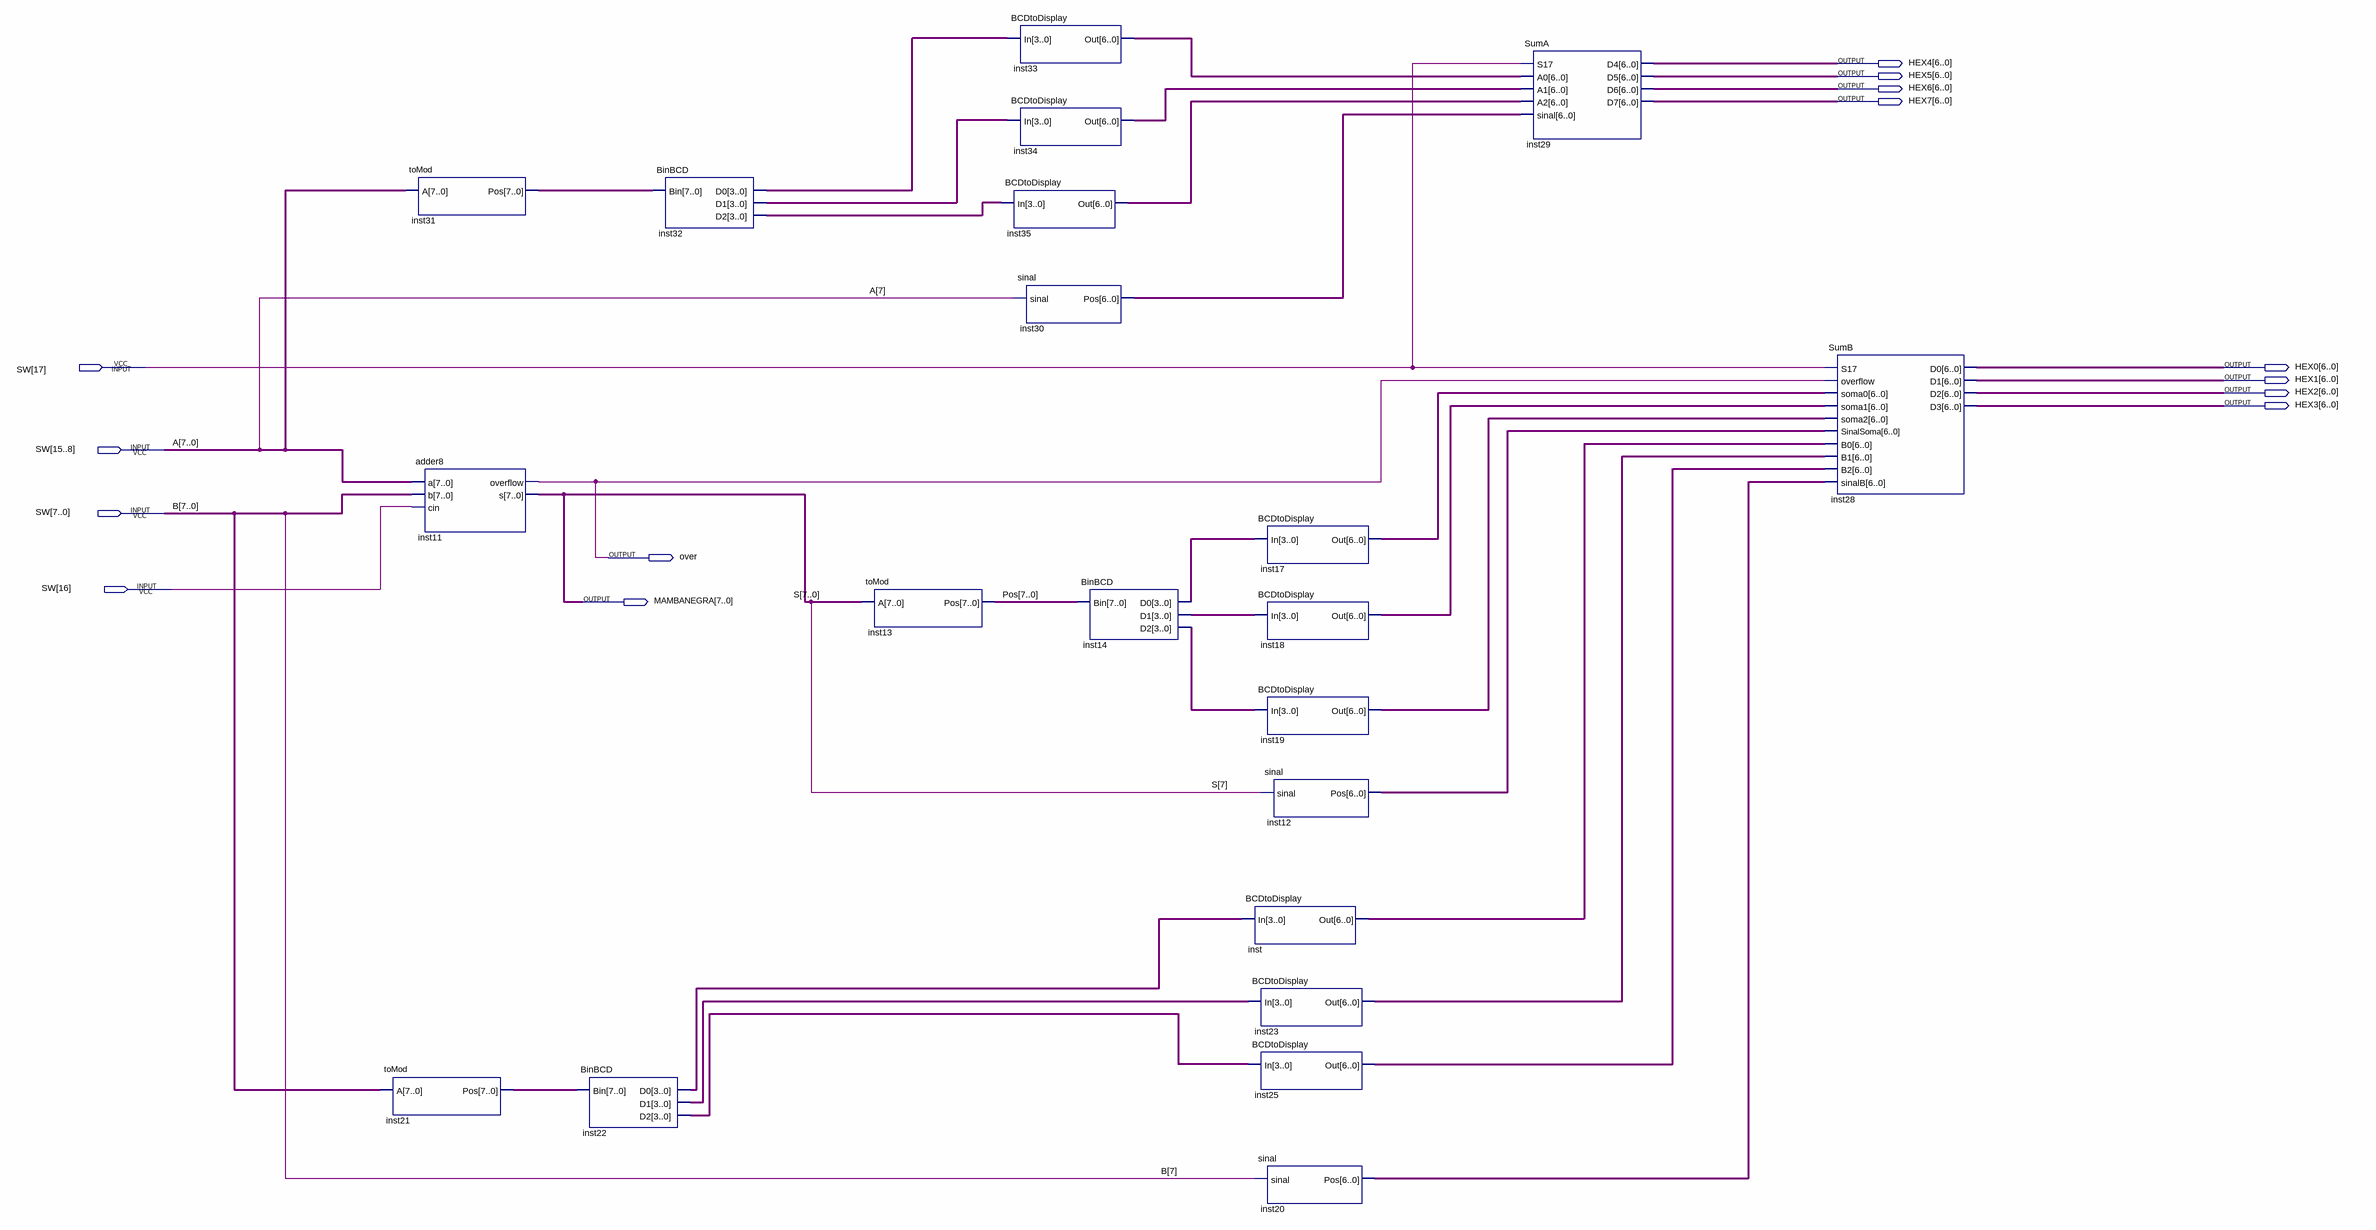
[diagram p0: schematic sheet]
// Quartus schematic Display.bdf as structural Verilog: 21 symbols, 14 pins
module Display (
  input  [17:0] SW,
  output [6:0] HEX4,
  output [6:0] HEX5,
  output [6:0] HEX6,
  output [6:0] HEX7,
  output [6:0] HEX0,
  output [6:0] HEX1,
  output [6:0] HEX2,
  output [6:0] HEX3,
  output over,
  output [7:0] MAMBANEGRA
);

  wire [3:0] inst14_d0, inst14_d1, inst14_d2, inst22_d0, inst22_d1, inst22_d2, inst32_d0, inst32_d1,
       inst32_d2;
  wire [6:0] inst12_pos, inst17_out, inst18_out, inst19_out, inst20_pos, inst23_out, inst25_out, inst30_pos,
       inst33_out, inst34_out, inst35_out, inst_out;
  wire [7:0] inst21_pos, inst31_pos, Pos;

  toMod inst21 (.A(SW[7:0]), .Pos(inst21_pos));
  toMod inst31 (.A(SW[15:8]), .Pos(inst31_pos));
  adder8 inst11 (.a(SW[15:8]), .b(SW[7:0]), .cin(SW[16]), .overflow(over), .s(MAMBANEGRA));
  BinBCD inst22 (.Bin(inst21_pos), .D0(inst22_d0), .D1(inst22_d1), .D2(inst22_d2));
  BinBCD inst32 (.Bin(inst31_pos), .D0(inst32_d0), .D1(inst32_d1), .D2(inst32_d2));
  toMod inst13 (.A(MAMBANEGRA), .Pos(Pos));
  BCDtoDisplay inst33 (.In(inst32_d0), .Out(inst33_out));
  BCDtoDisplay inst34 (.In(inst32_d1), .Out(inst34_out));
  BCDtoDisplay inst35 (.In(inst32_d2), .Out(inst35_out));
  sinal inst30 (.sinal(SW[15]), .Pos(inst30_pos));
  BinBCD inst14 (.Bin(Pos), .D0(inst14_d0), .D1(inst14_d1), .D2(inst14_d2));
  BCDtoDisplay inst (.In(inst22_d0), .Out(inst_out));
  BCDtoDisplay inst23 (.In(inst22_d1), .Out(inst23_out));
  BCDtoDisplay inst25 (.In(inst22_d2), .Out(inst25_out));
  BCDtoDisplay inst17 (.In(inst14_d0), .Out(inst17_out));
  BCDtoDisplay inst18 (.In(inst14_d1), .Out(inst18_out));
  BCDtoDisplay inst19 (.In(inst14_d2), .Out(inst19_out));
  sinal inst12 (.sinal(MAMBANEGRA[7]), .Pos(inst12_pos));
  sinal inst20 (.sinal(SW[7]), .Pos(inst20_pos));
  SumA inst29 (
    .S17(SW[17]), .A0(inst33_out), .A1(inst34_out), .A2(inst35_out), .sinal(inst30_pos), .D4(HEX4),
    .D5(HEX5), .D6(HEX6), .D7(HEX7));
  SumB inst28 (
    .S17(SW[17]), .overflow(over), .soma0(inst17_out), .soma1(inst18_out), .soma2(inst19_out),
    .SinalSoma(inst12_pos), .B0(inst_out), .B1(inst23_out), .B2(inst25_out), .sinalB(inst20_pos), .D0(HEX0),
    .D1(HEX1), .D2(HEX2), .D3(HEX3));

  // Other names for the same wires on the sheet: A[7:0] = SW[15:8]; B[7:0] = SW[7:0]; S[7:0] = MAMBANEGRA
endmodule
